# Altium schematic sheet Overall Schematic - Connection Test.SchDoc
size Legal; SheetNumber: 1; SheetTotal: 1
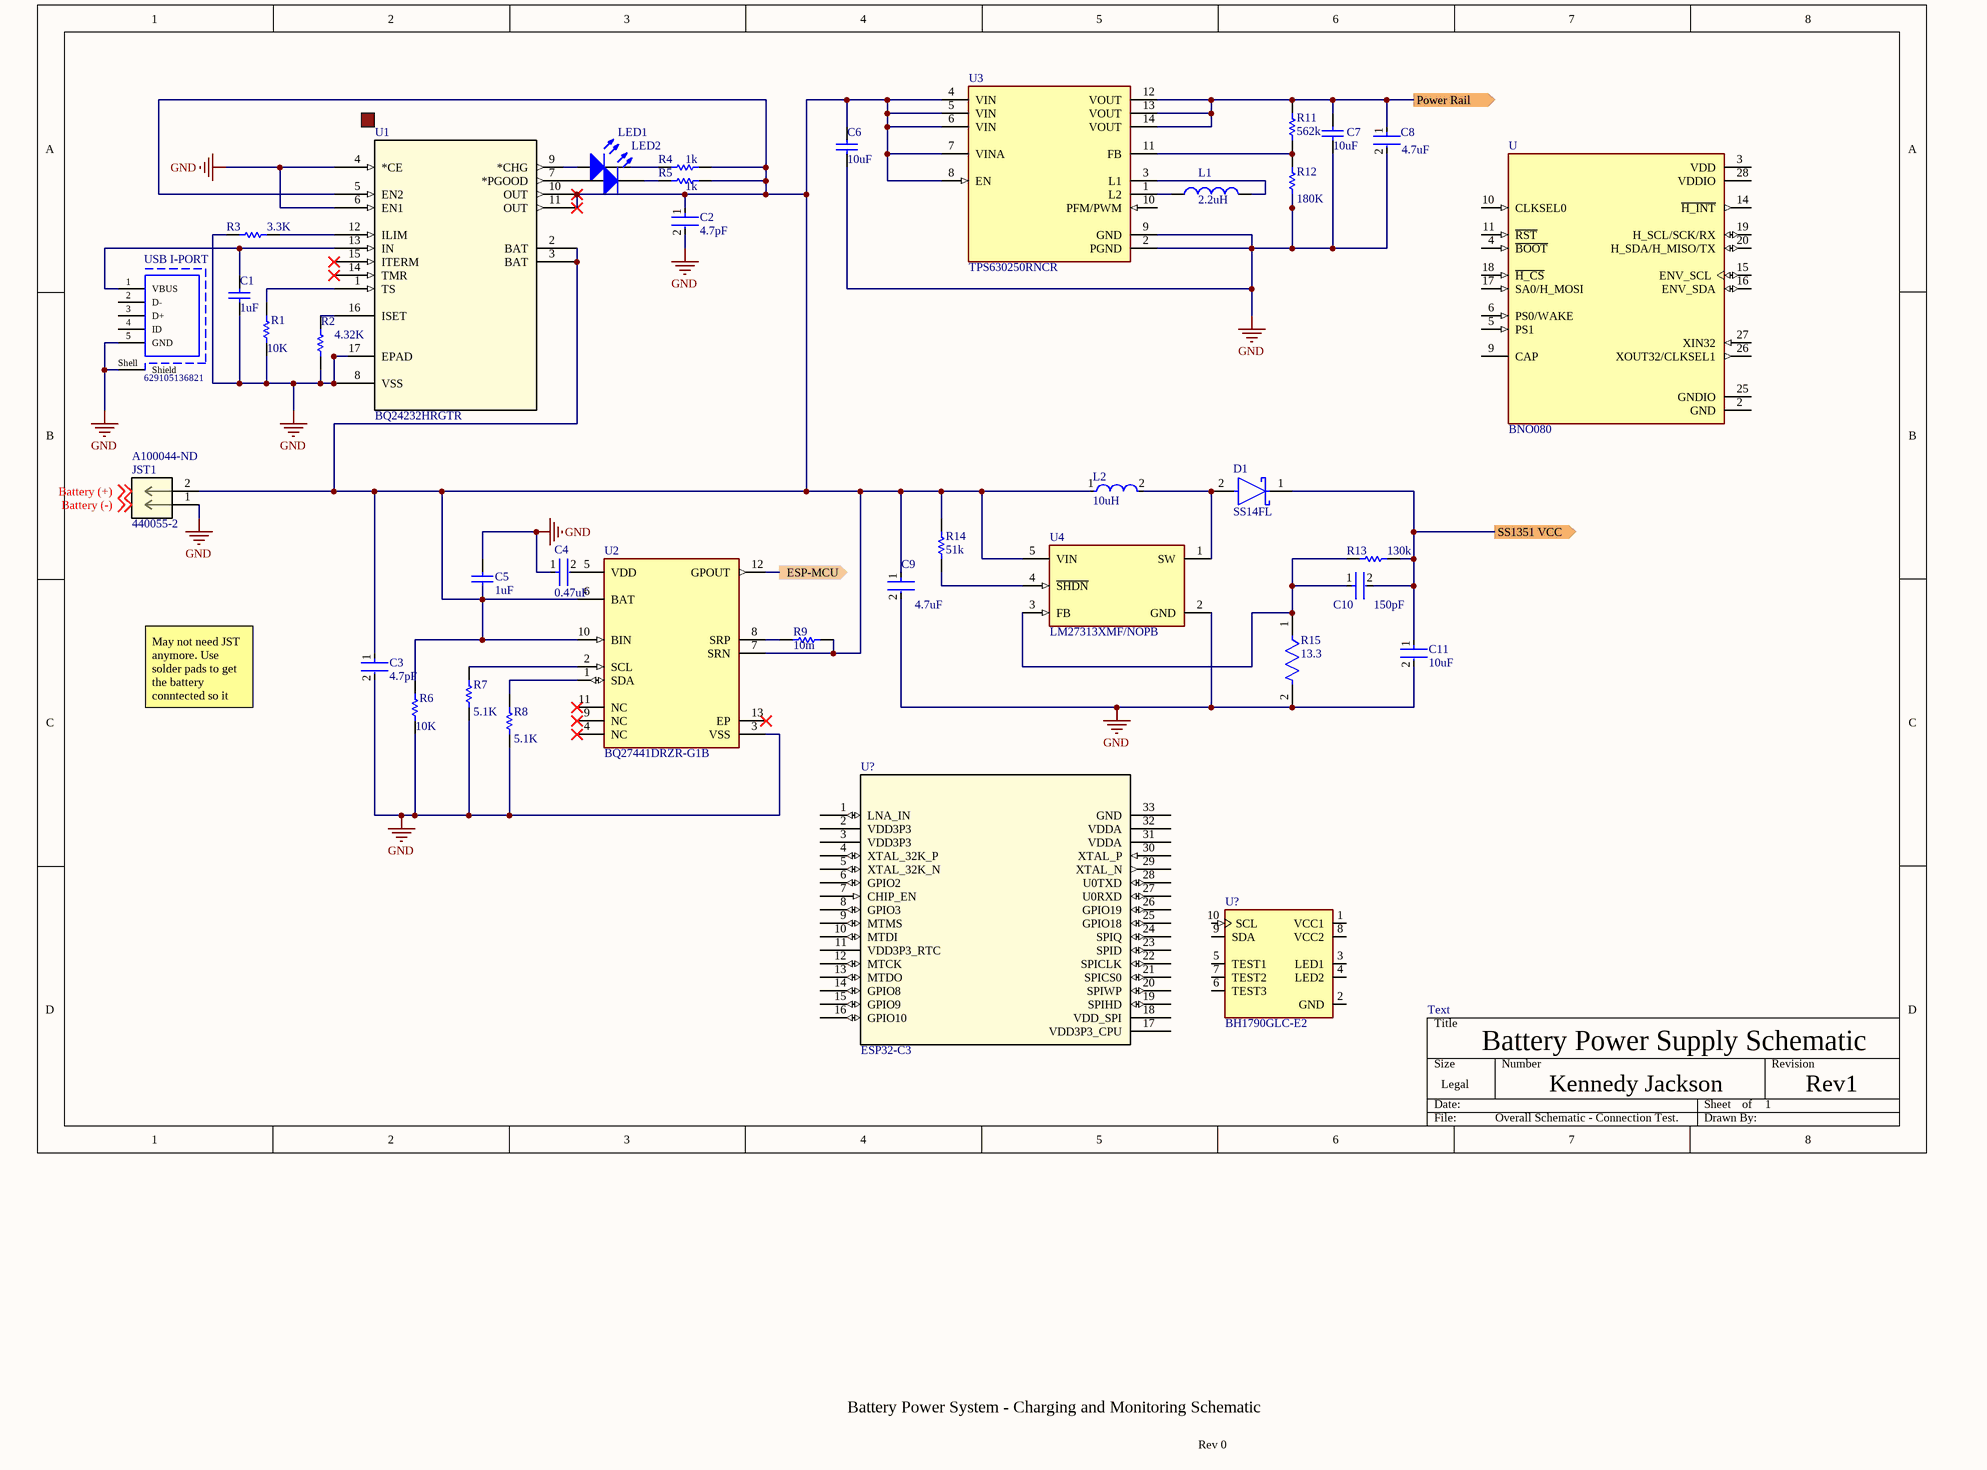
[diagram p0: Overall Schematic - Connection Test.SchDoc]

## Parts
(Parts that share a designator on the sheet are numbered #1, #2 ... from top to bottom, then left to right.)
C1  1uF  [CAPC2013X145X50LL20T25]
C2  4.7pF  [FP-CGA5L-0_3-0_1-MFG]
C3  4.7pF  [FP-CGA5L-0_3-0_1-MFG]
C4  0.47uF  [FP-C1206C-EB-MFG]
C5  1uF  [CAPC2013X145X50LL20T25]
C6  value 10uF  [CAPC340180_180N_KEM]  (hidden comment: Cap)
C7  value 10uF  [CAPC340180_180N_KEM]  (hidden comment: Cap)
C8  4.7uF  [FP-C3216-160-0_2-IPC_B]
C9  4.7uF  [FP-C3216-160-0_2-IPC_B]
C10  150pF  [FP-CL21-IPC_B]
C11  10uF  [FP-GRM21B-0_15-IPC_A]
D1  SS14FL  [FP-425AD-MFG]
JST1  440055-2  Supplier Part Number 1: A100044-ND  [CONN_440055-2_TEC]
L1  value 2.2uH  [0402-A]  (hidden comment: L1)
L2  10uH  [FP-CB2518-IPC_C]
LED1  CHRG LED INDIC  [3.2X1.6X1.1]  (value not drawn)
LED2  CHRG LED INDIC  [3.2X1.6X1.1]  (value not drawn)
R1  value 10K  [RESC3116X65N]  (hidden comment: Res1)
R2  value 4.32K  [RESC3216X70N]  (hidden comment: R_ISET)
R3  value 3.3K  [RESC3116X65N]  (hidden comment: R_ILIM)
R4  1k  [RES_ERA8AEB105V]
R5  1k  [RES_ERA8AEB105V]
R6  value 10K  [RESC3116X65N]  (hidden comment: Res1)
R7  value 5.1K  [RES_ERA8AEB512V]  (hidden comment: Res1)
R8  value 5.1K  [RES_ERA8AEB512V]  (hidden comment: Res1)
R9  value 10m  [RESC1632X60N]  (hidden comment: R_SENSE)
R11  562k  [RESC1609X50X30NL10T20]
R12  value 180K  [RES_ERA8AEB184V]  (hidden comment: R2)
R13  130k  [RESC3216X60X45LL10T20]
R14  51k  [RESC3116X65X40NL10T20]
R15  13.3  [FP-CRCW1206-e3-IPC_A]
U  BNO080  [IC_BNO080]
U1  BQ24232HRGTR  [RGT16_1P7X1P7_TEX]
U2  BQ27441DRZR-G1B  [FP-DRZ0012A-MFG]
U3  TPS630250RNCR  [FP-RNC0014A-MFG]
U4  LM27313XMF/NOPB  [FP-DBV0005A-IPC_A]
U?#1  ESP32-C3  [QFN32_5X5_EXP]
U?#2  BH1790GLC-E2  [PQFN70P280X280X100-10N]
USB_I-PORT  629105136821  [629105136821]

## Ports
ESP-MCU (out), Power Rail (out), SS1351 VCC (out)

## Nets
GND: C1.1 C2.2 C3.2 C4.1 C5.2 C6.2 C7.2 C8.2 C9.2 C11.2 JST1.1 R1.1 R2.1 R3.1 R6.1 R7.1 R8.1 R12.2 R15.2 U1.4(*CE) U1.6(EN1) U1.8(VSS) U1.17(EPAD) U2.3(VSS) U3.2(PGND) U3.9(GND) U4.2(GND) USB_I-PORT.5(GND) USB_I-PORT.Shell(Shield)
ESP-MCU: U2.12(GPOUT) ; port ESP-MCU
Power Rail: C7.1 C8.1 R11.2 U3.12(VOUT) U3.13(VOUT) U3.14(VOUT) ; port Power Rail
SS1351 VCC: C10.2 C11.1 D1.1(C) R13.1 ; port SS1351 VCC
NetC1_2: C1.2 U1.13(IN) USB_I-PORT.1(VBUS)
NetC2_1: C2.1 C3.1 C5.1 C6.1 C9.1 JST1.2 L2.1 R4.2 R5.2 R6.2 R9.2 R14.1 U1.2(BAT) U1.3(BAT) U1.5(EN2) U1.10(OUT) U1.11(OUT) U2.6(BAT) U2.7(SRN) U2.10(BIN) U3.4(VIN) U3.5(VIN) U3.6(VIN) U3.7(VINA) U3.8(EN) U4.5(VIN)
NetC4_2: C4.2 U2.5(VDD)
NetC10_1: C10.1 R13.2 R15.1 U4.3(FB)
NetD1_2: D1.2(A) L2.2 U4.1(SW)
NetL1_1: L1.1 U3.1(L2)
NetL1_2: L1.2 U3.3(L1)
NetLED1_1: LED1.1(A) U1.9(*CHG)
NetLED1_2: LED1.2(K) R4.1
NetLED2_1: LED2.1(A) U1.7(*PGOOD)
NetLED2_2: LED2.2(K) R5.1
NetR1_2: R1.2 U1.1(TS)
NetR2_2: R2.2 U1.16(ISET)
NetR3_2: R3.2 U1.12(ILIM)
NetR7_2: R7.2 U2.2(SCL)
NetR8_2: R8.2 U2.1(SDA)
NetR9_1: R9.1 U2.8(SRP)
NetR11_1: R11.1 R12.1 U3.11(FB)
NetR14_2: R14.2 U4.4(~{SHDN})

Not connected (* = marked no-connect by the designer): U 2(GND) 3(VDD) 4(~{BOOT}) 5(PS1) 6(PS0/WAKE) 9(CAP) 10(CLKSEL0) 11(~{RST}) 14(~{H_INT}) 15(ENV_SCL) 16(ENV_SDA) 17(SA0/H_MOSI) 18(~{H_CS}) 19(H_SCL/SCK/RX) 20(H_SDA/H_MISO/TX) 25(GNDIO) 26(XOUT32/CLKSEL1) 27(XIN32) 28(VDDIO); U1 14(TMR)* 15(ITERM)*; U2 4(NC)* 9(NC)* 11(NC)* 13(EP)*; U3 10(PFM/PWM); U?#1 1(LNA_IN) 2(VDD3P3) 3(VDD3P3) 4(XTAL_32K_P) 5(XTAL_32K_N) 6(GPIO2) 7(CHIP_EN) 8(GPIO3) 9(MTMS) 10(MTDI) 11(VDD3P3_RTC) 12(MTCK) 13(MTDO) 14(GPIO8) 15(GPIO9) 16(GPIO10) 17(VDD3P3_CPU) 18(VDD_SPI) 19(SPIHD) 20(SPIWP) 21(SPICS0) 22(SPICLK) 23(SPID) 24(SPIQ) 25(GPIO18) 26(GPIO19) 27(U0RXD) 28(U0TXD) 29(XTAL_N) 30(XTAL_P) 31(VDDA) 32(VDDA) 33(GND); U?#2 1(VCC1) 2(GND) 3(LED1) 4(LED2) 5(TEST1) 6(TEST3) 7(TEST2) 8(VCC2) 9(SDA) 10(SCL); USB_I-PORT 2(D-) 3(D+) 4(ID)

## Notes on the sheet
- (near U1) Should I add a cap between the output (Vbat) and the battery since they recommend charging the battery with 4.2V and the battery charger is set to supply 4.35V?
- May not need JST anymore. Use solder pads to get the battery conntected so it will stay in place.
- Text
- Battery Power Supply Schematic
- Kennedy Jackson
- 1
- Rev1
- Battery Power System - Charging and Monitoring Schematic
- Rev 0
- Labels drawn without touching a wire or pin: Battery (+), Battery (-)

## Library data of the parts
C1 = CMP-1036-04746-2: C0805C105K4PACTU; Manufacturer: Kemet; Part Number: C0805C105K4PACTU
C2 C3 = CMP-08246-000713-1: Cap Ceramic 4.7uF 25V X7R 10% Pad SMD 1206 +125°C Automotive T/R; Depth: 1.6mm; Case Code (Metric): 3216; Min Operating Temperature: -55°C; Lead Free: Lead Free; Max Operating Temperature: 125°C; Length: 3.2mm; Voltage Rating: 25V; Capacitance: 4.7uF; Dielectric: X7R; Tolerance: 10%; Packaging: Tape and Reel; Case Code (Imperial): 1206; Case/Package: 1206; Termination: SMD/SMT
C4 = CMP-03020-004832-1: CAP CER 0.47UF 25V 10% X7R 1206; Manufacturer Part Number: C1206C474K3RACTU; Manufacturer: KEMET; Automotive Grade: Grade 0; Temperature Coefficient: 15%; Value: 0.47 μF; Tolerance: 0.1; Material: Ceramic; Voltage Rating: 25 V; Device Class L2: Capacitors; Temperature Characteristic: X7R; Device Class L3: Ceramic Capacitors; Category: Cap; Digikey Description: CAP CER 0.47UF 25V 10% X7R 1206; Temperature Range Low: -55°C; Package: C1206C-EB; RoHS: TRUE; Mouser Description: Multilayer Ceramic Capacitors MLCC - SMD/SMT 25volts 0.47uF X7R 10%; Temperature Range High: +150°C; Lead Free: Yes; Temperature: -55°C to +150°C; Device Class L1: Passive Components; ComponentLink2Description: Datasheet; Octopart: https://octopart.com/c1206c474k3ractu-kemet-8089815; Height: 0.88mm; Automotive: Yes; Capacitance: 0.47 μF; ComponentLink2URL: https://content.kemet.com/datasheets/KEM_C1007_X8R_ULTRA_150C_SMD.pdf; Ipc Land Pattern Name: CAPC320160X78
C5 = CMP-1036-04746-2: Manufacturer: Kemet; Part Number: C0805C105K4PACTU
C6 C7 = Cap: Capacitor; Published: 8-Jun-2000; LatestRevisionDate: 17-Jul-2002; LatestRevisionNote: Re-released for DXP Platform.; PackageReference: RAD-0.3; Publisher: Altium Limited; PackageDescription: Radial Cap, Thru-Hole; 2 Leads; 0.3 in Pin Spacing; Supplier 1: RSComponents
C8 = CMP-08246-002666-1: C3216X7R1E475K160AC Multilayer Ceramic Capacitors 4.7uF ±10% 25V X7R SMD 1206; Case Code (Imperial): 1206; Max Operating Temperature: 125°C; Termination: SMD/SMT; Min Operating Temperature: -55°C; Capacitance: 4.7uF; Weight: 0.000571oz; Voltage Rating (DC): 25V; Width: 1.6mm; Case/Package: 1206; Package Quantity: 1; Resistor Type: Ceramic; RoHS Compliant: Yes; Dielectric: X7R; Height: 1.6mm; Mount: Surface Mount; REACH SVHC: No SVHC; Length: 3.2mm; Lead Free: Lead Free; Radiation Hardening: No; Case Code (Metric): 3216; Packaging: Tape and Reel; Series: C; Dielectric Material: Ceramic; Thickness: 0.071inch; Tolerance: 10%; Voltage Rating: 25V; Depth: 1.6mm; Voltage: 25V; Construction: Flat; Number of Pins: 2
C9 = CMP-08246-002666-1: Multilayer Ceramic Capacitors 4.7uF ±10% 25V X7R SMD 1206 (C3216X7R1E475K160AC); Case Code (Imperial): 1206; Max Operating Temperature: 125°C; Termination: SMD/SMT; Min Operating Temperature: -55°C; Capacitance: 4.7uF; Weight: 0.000571oz; Voltage Rating (DC): 25V; Width: 1.6mm; Case/Package: 1206; Package Quantity: 1; Resistor Type: Ceramic; RoHS Compliant: Yes; Dielectric: X7R; Height: 1.6mm; Mount: Surface Mount; REACH SVHC: No SVHC; Length: 3.2mm; Lead Free: Lead Free; Radiation Hardening: No; Case Code (Metric): 3216; Packaging: Tape and Reel; Series: C; Dielectric Material: Ceramic; Thickness: 0.071inch; Tolerance: 10%; Voltage Rating: 25V; Depth: 1.6mm; Voltage: 25V; Construction: Flat; Number of Pins: 2
C10 = CMP-13271-003387-1: CL21 Series 0805 150pF 50V ±5% Tolerance C0G Multilayer Ceramic Chip Capacitor (CL21C151JBANNNC); Height: 0.65mm; Case Code (Metric): 2012; Material: Ceramic; Voltage Rating: 50V; Length: 2mm; Package Quantity: 1; Mount: Surface Mount; Case Code (Imperial): 0805; Depth: 1.25mm; Dielectric: C0G; Contact Plating: Tin; Thickness: 0.03inch; Case/Package: 0805; Max Operating Temperature: 125°C; Min Operating Temperature: -55°C; Tolerance: 5%; Packaging: Tape and Reel; Radiation Hardening: No; Voltage: 50V; Capacitance: 150pF; Width: 0.049inch
C11 = CMP-06035-013048-1: Chip Multilayer Ceramic Capacitors for General Purpose, 0805, 10uF, X5R, 15%, 20%, 25V (GRM21BR61E106MA73L); Max Operating Temperature: 85°C; Package Quantity: 3000; Case/Package: 0805; Depth: 1.25mm; Case Code (Imperial): 0805; Termination: SMD/SMT; Width: 0.049inch; Packaging: Tape and Reel; Tolerance: 20%; Height: 1.25mm; Min Operating Temperature: -55°C; Capacitance: 10uF; Weight: 0.000335oz; Voltage Rating (DC): 25V; Dielectric: X5R; Length: 2mm; Thickness: 0.055inch; Voltage Rating: 25V; Resistor Type: Ceramic; Lead Free: Lead Free; Case Code (Metric): 2012; Mount: Surface Mount; REACH SVHC: No SVHC
D1 = CMP-07162-000013-1: DIODE SCHOTTKY 40V 1A SOD123F; Manufacturer: ON Semiconductor; Max Junction Temp: +125°C; Value: 60pF; Max Surge Forward Current: 40A; Peak Reverse Current: 30uA; Device Class L3: Schottky Diodes; Reverse Voltage: 40V; Automotive: No; Temperature: -55°C to +125°C; Mouser Description: SS14FL Series 40 V 1 A Surface Mount Schottky Barrier Rectifier - SOD-123F; Octopart: https://octopart.com/ss14fl-on+semiconductor-84331601; Height: 1.08mm; Temperature Range Low: -55°C; Category: Diode; Lead Free: Yes; Device Class L1: Discrete Semiconductors; Digikey Description: DIODE SCHOTTKY 40V 1A SOD123F; RoHS: TRUE; ComponentLink2Description: Datasheet; Manufacturer Part Number: SS14FL; Forward Current: 1A; Capacitance: 60pF; Package: 425AD; Device Class L2: Diodes; Temperature Range High: +125°C; Max Repetitive Reverse Voltage: 40V; ComponentLink2URL: https://www.onsemi.com/pub/Collateral/SS14FL-D.PDF
JST1 = 440055-2: No Description Available; Mfr_Name: TE Connectivity; Copyright: Copyright (C) 2021 Ultra Librarian. All rights reserved.; Manufacturer_Part_Number: 440055-2; RefDes: RefDes; Type: DEV; Supplier 1: Digi-Key
L1 = Inductor: Code_IEC: 1005; Published: 8-Jun-2000; LatestRevisionDate: 29-May-2009; LatestRevisionNote: IPC-7351 Footprint Added.; PackageReference: 0402-A; Publisher: Altium Limited; PackageDescription: Chip Inductor; Code_JEITA: 0402; Supplier 1: Newark; Supplier Part Number 1: 06W1235
L2 = CMP-14484-000020-1: CBC2518T100M SMD Inductors 10uH ±20% 0.68A 0.468Ω 1007; DC Current: 680mA; Shielding: Unshielded; Core Material: Ferrite; Resistance: 0.36R; Saturation Current: 480mA; Self Resonant Frequency: 30MHz; Test Frequency: 2.52MHz; DC Resistance (DCR): 468mR; Resistor Type: Wirewound; Halogen Free: Halogen Free; Width: 0.071inch; Current Rating: 680mA; Case Code (Imperial): 1007; Height - Seated (Max): 0.079inch; Mount: Surface Mount; Case/Package: 1007; Tolerance: 20%; Min Operating Temperature: -40°C; Radiation Hardening: No; Inductance Tolerance: 20%; Case Code (Metric): 2518; Military Standard: Not; Inductance: 10uH; Max DC Current: 680mA; Depth: 2mm; Termination: SMD/SMT; RoHS Compliant: Yes; Packaging: Tape and Reel; Series: CB; Height: 1.8mm; Package Quantity: 2000; Lead Free: Lead Free; Max Operating Temperature: 105°C; Length: 0.098inch
LED1 LED2 = LED2: Typical RED, GREEN, YELLOW, AMBER GaAs LED; Published: 8-Jun-2000; LatestRevisionDate: 17-Jul-2002; LatestRevisionNote: Re-released for DXP Platform.; PackageVersion: Feb-2002; PackageReference: 3.2X1.6X1.1; Publisher: Altium Limited; PackageDescription: SM LED; 2 Flat Leads
R1 R3-R8 R12 = Res1: Resistor; Published: 8-Jun-2000; LatestRevisionDate: 17-Jul-2002; LatestRevisionNote: Re-released for DXP Platform.; PackageReference: AXIAL-0.3; Publisher: Altium Limited; PackageDescription: Axial Device, Thru-Hole; 2 Leads; 0.3 in Pin Spacing
  R1 R6: Supplier 1: Arrow Electronics; Supplier Part Number 1: TNPW120610K0BEEA
  R3: Supplier 1: Digi-Key; Supplier Part Number 1: YAG2045CT-ND
  R4 R5: Value: 1k; Supplier 1: Digi-Key; Supplier Part Number 1: P1.0MBCCT-ND
  R7 R8: Supplier 1: Digi-Key; Supplier Part Number 1: P5.1KBCCT-ND
  R12: Supplier 1: Digi-Key; Supplier Part Number 1: P180KBCCT-ND
R2 = Res1: Resistor (model is 3.3 real valye is 4.32); Published: 8-Jun-2000; LatestRevisionDate: 17-Jul-2002; LatestRevisionNote: Re-released for DXP Platform.; PackageReference: AXIAL-0.3; Publisher: Altium Limited; PackageDescription: Axial Device, Thru-Hole; 2 Leads; 0.3 in Pin Spacing; Supplier 1: Mouser; Supplier Part Number 1: 660-RN732BTTDK4321
R9 = Res1: Resistor / 1% Tol required / 1W PWR Rating required; Published: 8-Jun-2000; LatestRevisionDate: 17-Jul-2002; LatestRevisionNote: Re-released for DXP Platform.; PackageReference: AXIAL-0.3; Publisher: Altium Limited; PackageDescription: Axial Device, Thru-Hole; 2 Leads; 0.3 in Pin Spacing; Supplier 1: Digi-Key; Supplier Part Number 1: PRL1632.010FCT-ND
R11 = CMP-2000-03465-1: CRCW0603562KFKEA; Manufacturer: Vishay Dale; Part Number: CRCW0603562KFKEA
R13 = CMP-2003-01786-1: Manufacturer: Vishay Dale; Part Number: CRCW1206130KFKEA
R14 = CMP-2003-03796-1: RC1206FR-0751KL; Manufacturer: Yageo; Part Number: RC1206FR-0751KL
R15 = CMP-2003-01799-2: RES Thick Film, 13.3Ω, 1%, 0.25W, 100ppm/°C, 1206 (CRCW120613R3FKEA); Resistance: 13.3R; Voltage Rating (DC): 200V; Power Rating: 250mW; Length: 3.2mm; Weight: 0.000353oz; Temperature Coefficient: 100ppm/°C; Depth: 1.6mm; Case Code (Imperial): 1206; Min Operating Temperature: -55°C; Features: Automotive AEC-Q200; Lead Free: Lead Free; Composition: Thick Film; Case/Package: 1206; Radiation Hardening: No; Tolerance: 1%; Width: 0.063inch; Contact Plating: Tin; Military Standard: Not; Voltage Rating: 200V; Number of Terminations: 2; Number of Pins: 2; Case Code (Metric): 3216; Max Operating Temperature: 155°C; Height: 0.024inch; Packaging: Tape and Reel; Max Power Dissipation: 250mW; Package Quantity: 5000
U = BNO080: Accelerometer, Gyroscope, Magnetometer, 9 Axis Sensor IÂ²C, SPI, UART Output; MF: Hillcrest Laboratories,; Package: TFLGA-28 Hillcrest Laboratories,; Digi-Key_Purchase_URL: https://www.digikey.com/product-detail/en/hillcrest-laboratories-inc/BNO080/1888-1000-1-ND/7917169?utm_source=snapeda&utm_medium=aggregator&utm_campaign=symbol; Value: *; MP: BNO080; SnapEDA_Link: https://www.snapeda.com/parts/BNO080/Hillcrest%20Laboratories%2C%20Inc./view-part/2769909/?ref=snap; Digi-Key_Part_Number: 1888-1000-1-ND
U1 = BQ24232HRGTR: No Description Available; Mfr_Name: Texas Instruments; Copyright: Copyright (C) 2021 Ultra Librarian. All rights reserved.; Manufacturer_Part_Number: BQ24232HRGTR; RefDes: RefDes; Type: DEV
U2 = CMP-04911-000067-1: IC BATT FUEL GAUGE LI-ION 12SON; Operating Supply Voltage: 4.5V; Output Current: 500uA; Interface: I2C; Output Voltage: 600mV; Capacity: 8000mAh; Number of Cells: 1; Min Supply Voltage: -300mV; Max Supply Voltage: 6V; Package Quantity: 3000; Packaging: Tape and Reel; Mount: Surface Mount; Min Operating Temperature: -40°C; Max Operating Temperature: 85°C; Contact Plating: Gold; Number of Pins: 12; Lead Free: Lead Free
U3 = CMP-04918-000391-1: IC REG BCK BST ADJ 2A/4A 14VQFN; Voltage Rating: 50V; ESR (Equivalent Series Resistance): 50mR; Min Input Voltage: 2.3V; Max Input Voltage: 5.5V; Capacitance: 33uF; Output Current: 4A; Quiescent Current: 35uA; Number of Outputs: 1; Output Configuration: Positive; Max Output Voltage: 3.6V; Topology: Buck-Boost; Life (Hours): 2000Hour; Output Type: Adjustable; Switching Frequency: 2.5MHz; Tolerance: 20%; Synchronous Rectifier: Yes; Features: General Purpose; Packaging: Tape and Reel; Mount: Surface Mount; Max Operating Temperature: 85°C; Min Operating Temperature: -40°C; RoHS Compliant: Yes; Lead Free: Lead Free; Number of Pins: 14; Case/Package: 2917; Min Output Voltage: 2.3V
U4 = CMP-0069-01219-5: IC REG BOOST ADJ 800MA SOT23-5; Min Output Voltage: 4V; Min Input Voltage: 2.7V; Quiescent Current: 2.1mA; Max Input Voltage: 14V; Output Power: 2.5W; Number of Outputs: 1; Output Configuration: Positive; Output Type: Adjustable; Max Output Voltage: 28V; Synchronous Rectifier: No; Switching Frequency: 1.6MHz; Efficiency: 80%; Height: 1.02mm; Number of Pins: 5; Package Quantity: 1; Output Current: 800mA; Min Operating Temperature: -40°C; RoHS Compliant: Yes; Contact Plating: Tin; Max Operating Temperature: 125°C; Series: LM27313; Mount: Surface Mount; Length: 2.92mm; Case/Package: SOT-23-5; Width: 1.6mm; Output Voltage: 28V; Topology: Boost; Lead Free: Lead Free; Max Output Current: 800mA; REACH SVHC: No SVHC; Packaging: Tape and Reel; Radiation Hardening: No
U?#1 = ESP32-C3: No Description Available; Mfr_Name: Espressif Systems; Copyright: Copyright (C) 2022 Ultra Librarian. All rights reserved.; Manufacturer_Part_Number: ESP32-C3; RefDes: RefDes; Type: DEV
U?#2 = BH1790GLC-E2: Oximeter/Heart Rate Sensor IÂ²C Output; MF: Rohm; Package: LGA-10 Rohm; MP: BH1790GLC-E2; Mouser-Purchase-URL: https://snapeda.com/shop?store=Mouser&id=2761766; Price: None; Availability: Warning; Value: *; SnapEDA_Link: https://www.snapeda.com/parts/BH1790GLC-E2/Rohm/view-part/2761766/?ref=snap
USB_I-PORT = CMP-1502-03253-1: Micro USB 2.0 Type B Receptacle WR-COM, Horizontal, SMT, with Pads and Pegs; Manufacturer: Wurth Elektronik; Contact Resistance: 30mOhm; Rated Current: 1A; Working Voltage: 30VAC; Datasheet URL: https://katalog.we-online.de/em/datasheet/629105136821.pdf; Mounting Technology: SMT; Publisher: WurthElektronik; Package Reference: 629105136821; Orientation: Horizontal; Packaging: TapeandReel; Part Number: 629105136821; Manufacturer URL: http://www.we-online.de; Connector Type: MicroUSB2.0TypeB; Gender: Receptacle; Operating Temperature: -40to105degC